# EAGLE design AT24-Timer-NEW (EAGLE 9.6.2)
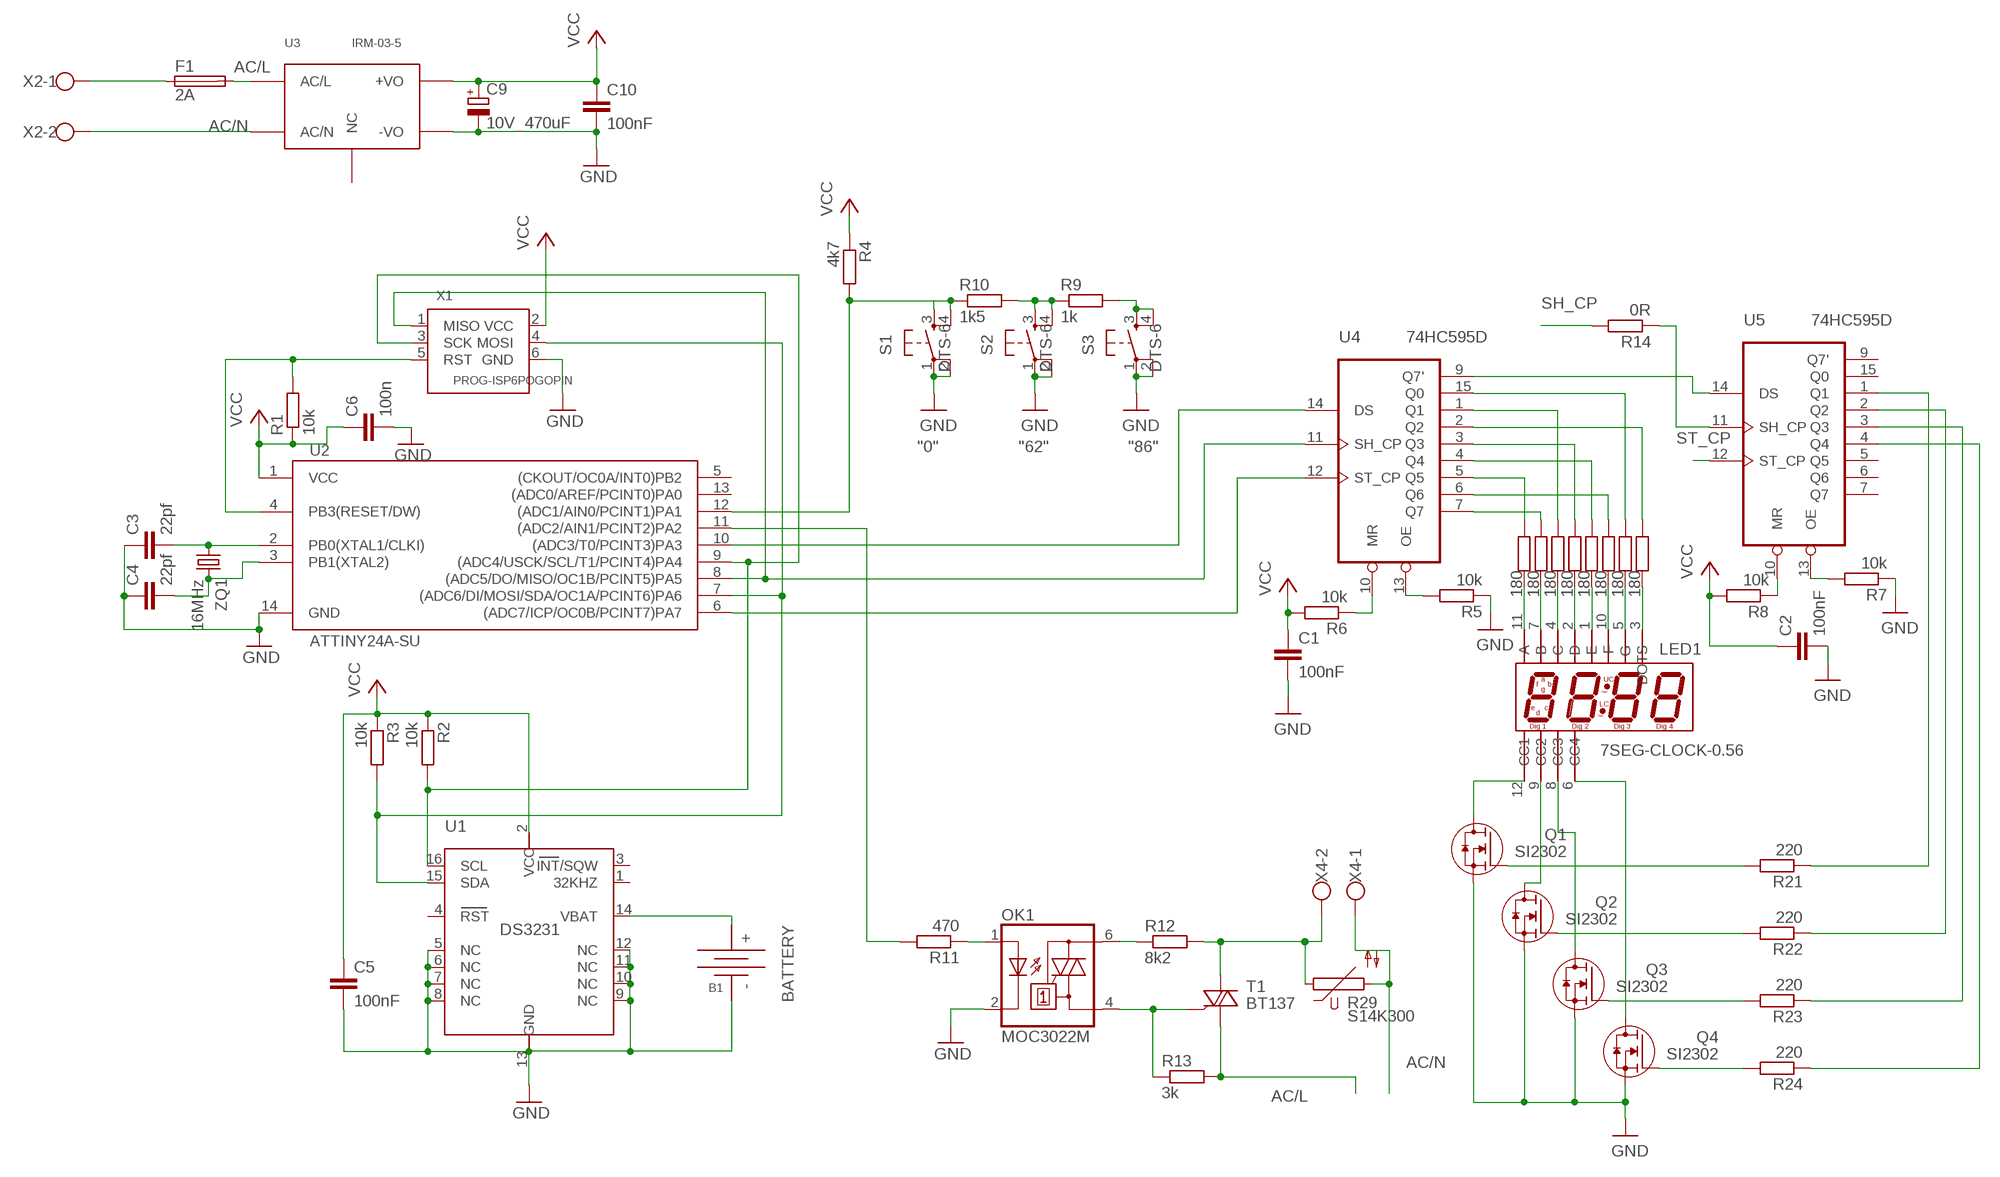
[diagram p0: schematic, sheet 1]

## Parts
B1  BATTERY  [BTH2032-3]
C1  100nF  C-EUC0603  [C0603]
C2  100nF  C-EUC0603  [C0603]
C3  22pf  C-EUC0603  [C0603]
C4  22pf  C-EUC0603  [C0603]
C5  100nF  C-EUC0603  [C0603]
C6  100n  C-EUC0603  [C0603]
C9  10V_470uF  CPOL-EUD/7343-31W  [D/7343-31W]
C10  100nF  C-EUC0805K  [C0805K]
F1  2A  SH22,5A  [SH22,5A]
LED1  7SEG-CLOCK-0.56  [7SEG_4DIG_0.56]
OK1  MOC3022M  [DIL06]
Q1  SI2302  [SOT-23-GSD]
Q2  SI2302  [SOT-23-GSD]
Q3  SI2302  [SOT-23-GSD]
Q4  SI2302  [SOT-23-GSD]
R1  10k  R-EU_R0805  [R0805]
R2  10k  R-EU_R0805  [R0805]
R3  10k  R-EU_R0805  [R0805]
R4  4k7  R-EU_R0805  [R0805]
R5  10k  R-EU_R0805  [R0805]
R6  10k  R-EU_R0805  [R0805]
R7  10k  R0805  [0805R]
R8  10k  R-EU_R0805  [R0805]
R9  1k  R-EU_R0805  [R0805]
R10  1k5  R-EU_R0805  [R0805]
R11  470  R-EU_R0805  [R0805]
R12  8k2  R-EU_0207/7  [0207/7]
R13  3k  R-EU_0207/7  [0207/7]
R14  0R  R0805  [0805R]
R17  180  R-EU_R0805  [R0805]
R18  180  R-EU_R0805  [R0805]
R19  180  R-EU_R0805  [R0805]
R20  180  R-EU_R0805  [R0805]
R21  220  R-EU_R0805  [R0805]
R22  220  R-EU_R0805  [R0805]
R23  220  R-EU_R0805  [R0805]
R24  220  R-EU_R0805  [R0805]
R25  180  R-EU_R0805  [R0805]
R26  180  R-EU_R0805  [R0805]
R27  180  R-EU_R0805  [R0805]
R28  180  R-EU_R0805  [R0805]
R29  S14K300  [S14K300]
S1  DTS-6  [DTS-6]
S2  DTS-6  [DTS-6]
S3  DTS-6  [DTS-6]
T1  BT137  BT136  [TO220AB]
U1  DS3231  [SO16L]
U2  ATTINY24A-SU  [SO14]
U3  IRM-03-5  [IRM-03-*]
U4  74HC595D  [SO16]
U5  74HC595D  [SO16]
X1  PROG-ISP6POGOPIN  [PROG_POGOPIN]
X2  W237-102  [W237-102]
X4  W237-102  [W237-102]
ZQ1  16MHz  CRYSTALHC49S  [HC49/S]

## Nets
AC/L: F1.2 R13.2 T1.1(A1) U3.P$1(AC/L)
AC/N: R29.2 U3.P$2(AC/N) X2.2 X4.1
GND: B1.- C1.2 C2.2 C3.1 C4.1 C5.2 C6.2 C9.- C10.2 OK1.2(C) Q1.S Q2.S Q3.S Q4.S R5.1 R7.1 S1.1 S1.2 S2.1 S2.2 S3.1 S3.2 U1.5(NC) U1.6(NC) U1.7(NC) U1.8(NC) U1.9(NC) U1.10(NC) U1.11(NC) U1.12(NC) U1.13(GND) U2.14(GND) U3.P$4(-VO) X1.6(GND)
N$1: OK1.6(A2) R12.1
N$2: F1.1 X2.1
N$3: R3.2 U1.15(SDA) U2.7((ADC6/DI/MOSI/SDA/OC1A/PCINT6)PA6) X1.4(MOSI)
N$4: R2.2 U1.16(SCL) U2.9((ADC4/USCK/SCL/T1/PCINT4)PA4) X1.3(SCK)
N$5: R1.2 U2.4(PB3(RESET/DW)) X1.5(RST)
N$6: R4.2 R10.1 S1.3 S1.4 U2.12((ADC1/AIN0/PCINT1)PA1)
N$7: C3.2 U2.2(PB0(XTAL1/CLKI)) ZQ1.1
N$8: C4.2 U2.3(PB1(XTAL2)) ZQ1.2
N$9: R6.1 U4.10(MR)
N$10: R12.2 R29.1 T1.2(A2) X4.2
N$11: U2.10((ADC3/T0/PCINT3)PA3) U4.14(DS)
N$12: R14.1 U5.11(SH_CP)
N$16: R9.1 S3.3 S3.4
N$17: OK1.4(A1) R13.1 T1.3(G)
N$20: R5.2 U4.13(OE)
N$21: OK1.1(A) R11.1
N$22: R8.1 U5.10(MR)
N$25: R7.2 U5.13(OE)
N$28: R17.1 U4.5(Q5)
N$29: R18.1 U4.7(Q7)
N$30: U4.9(Q7') U5.14(DS)
N$31: R19.1 U4.1(Q1)
N$32: R20.1 U4.3(Q3)
N$33: R25.1 U4.4(Q4)
N$34: R26.1 U4.6(Q6)
N$35: R27.1 U4.15(Q0)
N$36: R28.1 U4.2(Q2)
N$37: LED1.12(CC1) Q1.D
N$38: LED1.9(CC2) Q2.D
N$39: LED1.8(CC3) Q3.D
N$40: LED1.6(CC4) Q4.D
N$41: R21.1 U5.1(Q1)
N$42: R22.1 U5.2(Q2)
N$43: R23.1 U5.3(Q3)
N$44: R24.1 U5.4(Q4)
N$51: LED1.11(A) R17.2
N$52: LED1.7(B) R18.2
N$55: LED1.4(C) R19.2
N$56: B1.+ U1.14(VBAT)
N$57: LED1.2(D) R20.2
N$58: LED1.1(E) R25.2
N$59: LED1.10(F) R26.2
N$60: LED1.5(G) R27.2
N$61: LED1.3(DOTS) R28.2
N$65: Q4.G R24.2
N$66: Q3.G R23.2
N$67: Q2.G R22.2
N$68: Q1.G R21.2
N$160: R9.2 R10.2 S2.3 S2.4
OPTOCOUP: R11.2 U2.11((ADC2/AIN1/PCINT2)PA2)
SH_CP: R14.2 U2.8((ADC5/DO/MISO/OC1B/PCINT5)PA5) U4.11(SH_CP) X1.1(MISO)
ST_CP: U2.6((ADC7/ICP/OC0B/PCINT7)PA7) U4.12(ST_CP) U5.12(ST_CP)
VCC: C1.1 C2.1 C5.1 C6.1 C9.+ C10.1 R1.1 R2.1 R3.1 R4.1 R6.2 R8.2 U1.2(VCC) U2.1(VCC) U3.P$5(+VO) X1.2(VCC)
Unconnected: U1.1(32KHZ) U1.3(INT/SQW) U1.4(RST) U2.5((CKOUT/OC0A/INT0)PB2) U2.13((ADC0/AREF/PCINT0)PA0) U5.5(Q5) U5.6(Q6) U5.7(Q7) U5.9(Q7') U5.15(Q0)

## Notes on the sheet
- "0" | "62" | "86"

## Power pins joined to a net without a drawn wire
GND: U4.8(GND) U5.8(GND)
NC: U3.P$3(NC)
VCC: U4.16(VCC) U5.16(VCC)

## Library data of the parts
B1 = usb:BATTERY
C1-C6 C10 = rcl:C-EU: CAPACITOR, European symbol; SPICEPREFIX: C
C9 = rcl:CPOL-EU: POLARIZED CAPACITOR, European symbol; SPICEPREFIX: C
F1 = fuse:SH22,5A: FUSE HOLDER grid 22,5mm, isolated cap OGN0031 8201, Schurter (Buerklin); MPN: 0031.7701.11; OC_FARNELL: unknown; OC_NEWARK: 04F1224
LED1 = usb:7SEG-CLOCK-0.56
OK1 = optocoupler:MOC30*M: RANDOM-PHASE OPTOISOLATORS TRIAC DRIVER OUTPUT Source: http://www.fairchildsemi.com MOC3020-M.pdf; MF: FAIRCHILD SEMICONDUCTOR; MPN: MOC3022-M; OC_FARNELL: 1021086; OC_NEWARK: 58K1956
Q1-Q4 = usb:SI2302: N-канальный полевик
R1-R6 R8-R13 R17-R28 = rcl:R-EU_: RESISTOR, European symbol; SPICEPREFIX: R
R7 R14 = usb:R0805
R29 = varistor:S14K300: VARISTOR
S1-S3 = usb:DTS-6
T1 = triac:BT136: Triac BT136 series E sensitive gate Source: http://www.nxp.com/acrobat_download/datasheets/BT136_SERIES_E_2.pdf
U1 = usb:DS3231: Real-Time Clock DS3231
U2 = usb:ATTINY24A: ATTiny24A ATTiny44A ATTiny84A
U3 = usb:IRM-03-*: IRM-03-*
U4 U5 = 74xx-eu:74*595: 8-bit SHIFT REGISTER, output latch
X1 = usb:PROG-ISP
X2 X4 = con-wago-500:W237-102: WAGO SCREW CLAMP; MPN: 237-102; OC_FARNELL: unknown; OC_NEWARK: 70K9898
ZQ1 = crystal:CRYSTAL: CRYSTAL; OC_FARNELL: 1667008; OC_NEWARK: unknown

## Board
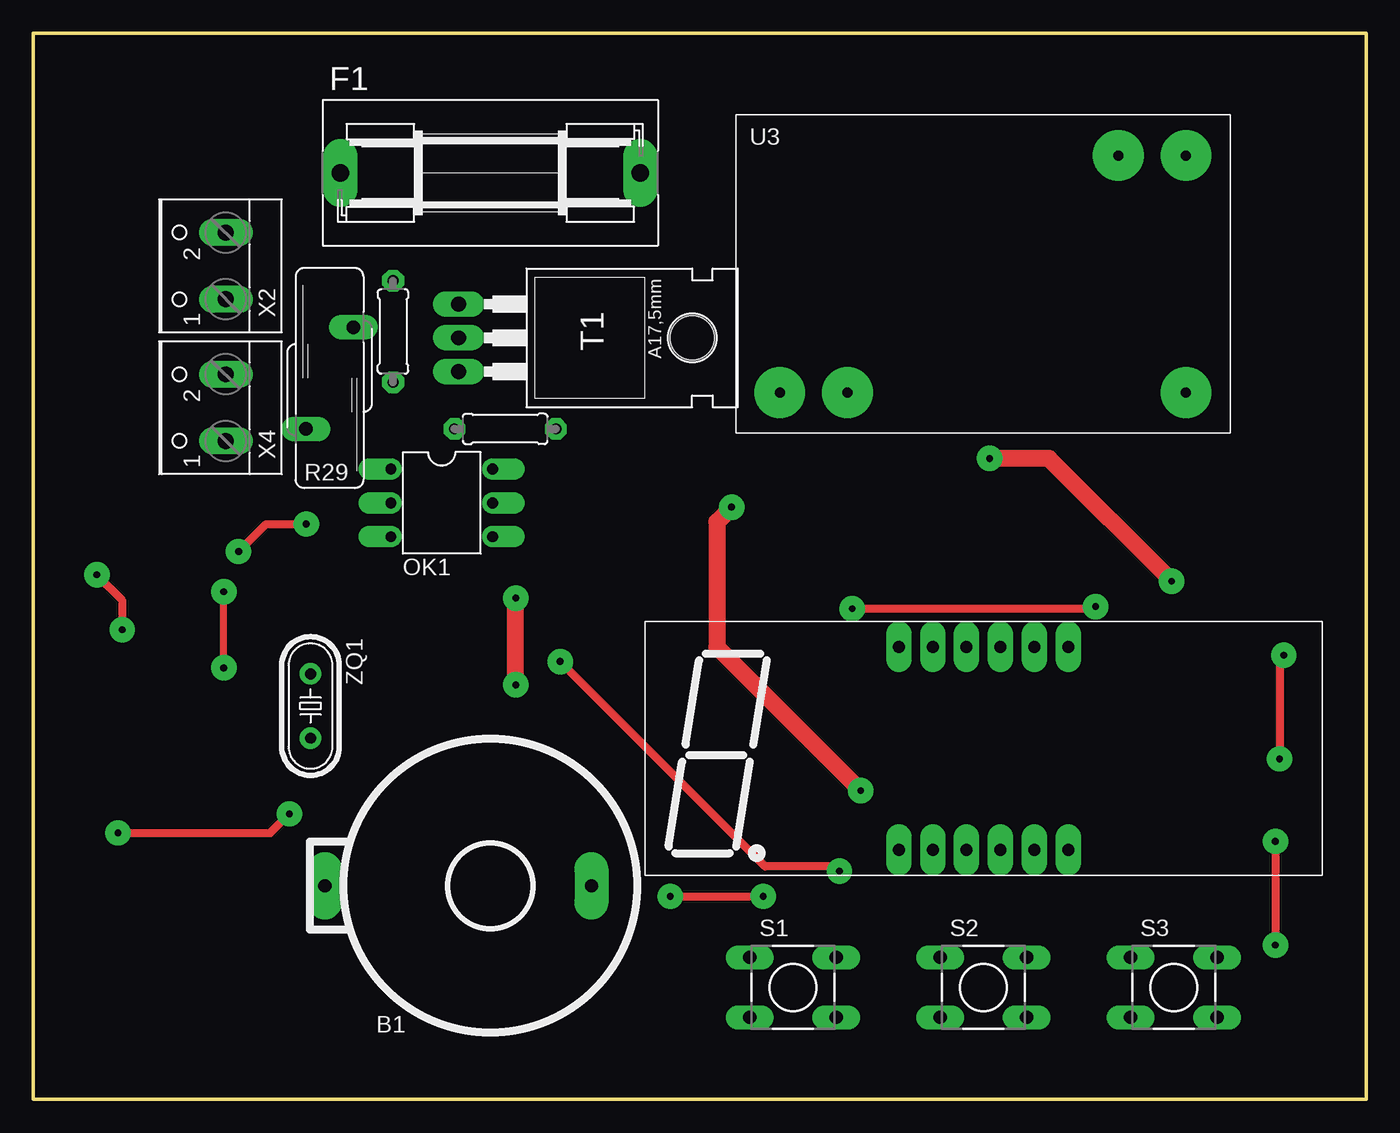
[diagram p1: board, top side]
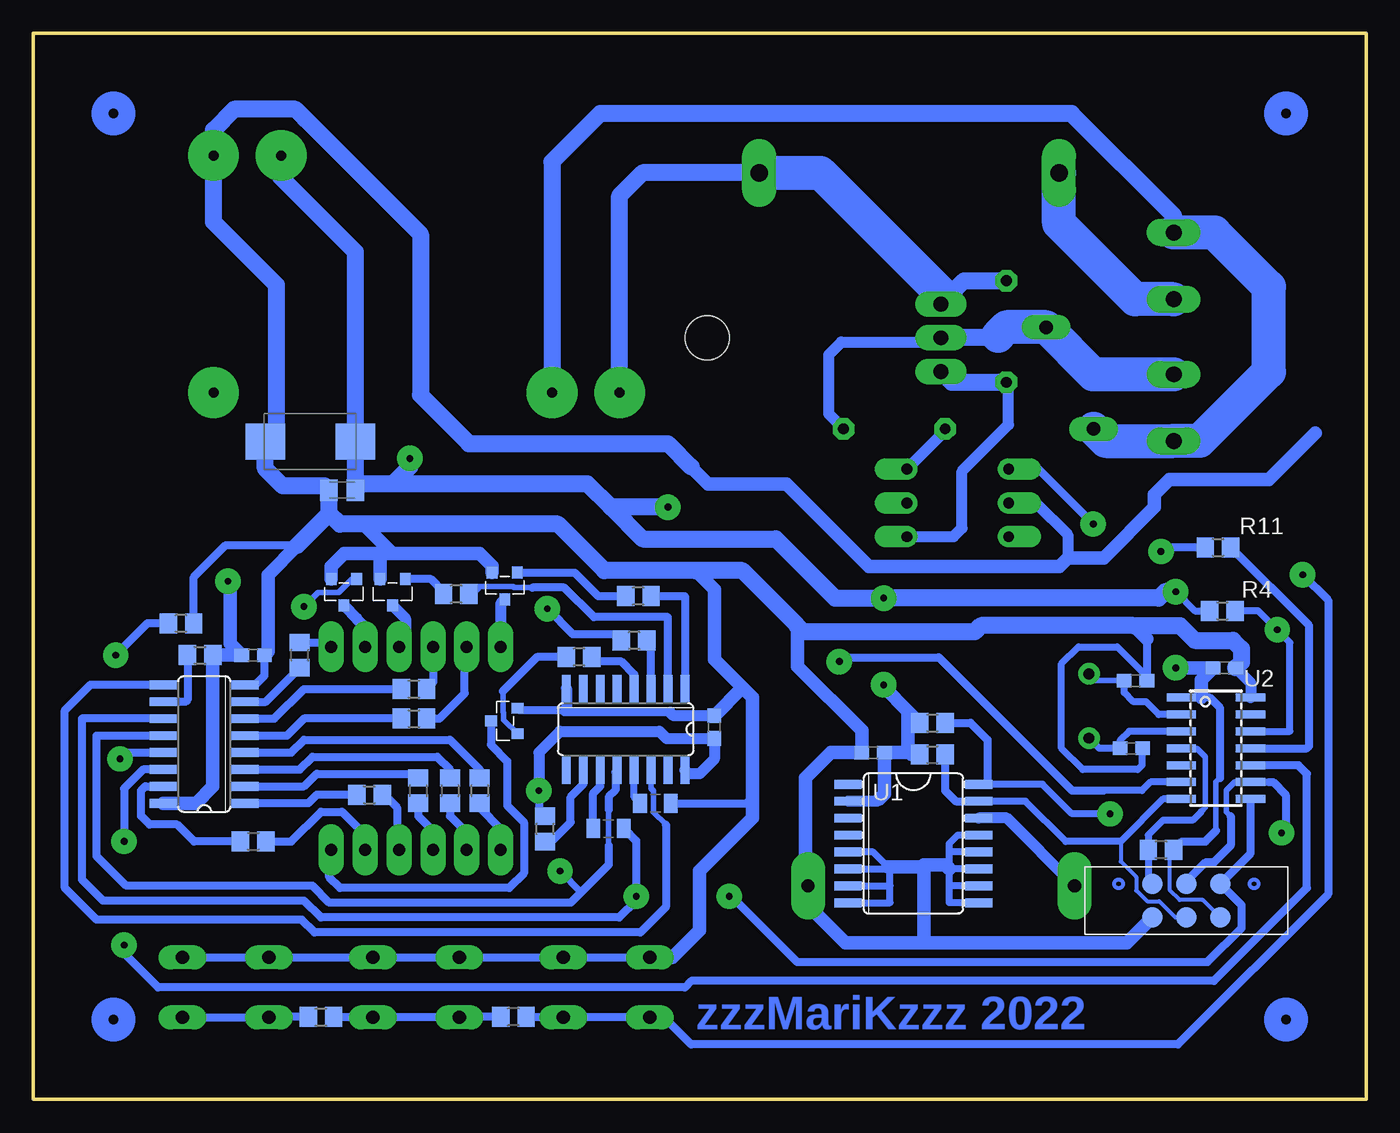
[diagram p2: board, bottom side, seen from below]

Size 100 x 80 mm. Coordinates in mm from the lower left corner, seen from the top.
Outline: 0,0 100,0 100,80 0,80 0,0
Copper layers (1*16): Top 0.035mm / dielectric 1.5mm / Bottom 0.035mm
Design rules "default *": minimum track width 12mil, minimum drill 20mil, track to track 12mil, track to pad 12mil, pad to pad 12mil, via to via 12mil, smd to smd 8mil, copper to edge 20mil, drill to drill 8mil, minimum pad ring 16mil, minimum via ring 12mil, stop-mask expansion 4mil, vias tented up to drill 0mil, thermal gap 20mil

### Footprints (pad centres in the part's own frame; a part is rotated, then mirrored left to right if it is on the bottom)
BTH2032-3 = drill 1 pad 2.54 long: + 0,-20.032; - 0,-0.033
C0603 = smd 1.1 x 1: 1 -0.85,0; 2 0.85,0
D/7343-31W = smd 2.95 x 2.7: + 3.375,0; - -3.375,0
C0805K = smd 1.3 x 1.6: 1 -1,0; 2 1,0
SH22,5A = drill 1.321 pad 2.54 long: 1 -11.252,0; 2 11.252,0
7SEG_4DIG_0.56 = drill 0.9 pad 1.93 long: 1 -5.08,-2.54; 2 -2.54,-2.54; 3 0,-2.54; 4 2.54,-2.54; 5 5.08,-2.54; 6 7.62,-2.54; 7 7.62,12.7; 8 5.08,12.7; 9 2.54,12.7; 10 0,12.7; 11 -2.54,12.7; 12 -5.08,12.7
DIL06 = drill 0.813 offset: 1 -2.54,-3.81; 2 0,-3.81; 3 2.54,-3.81; 4 2.54,3.81; 5 0,3.81; 6 -2.54,3.81
SOT-23-GSD = smd 0.8 x 0.9: D 0,2; G -0.95,0; S 0.95,0
R0805 = smd 1.3 x 1.5: 1 -0.95,0; 2 0.95,0
0805R = smd 1.016 x 1.422: 1 -1.16,0.01; 2 1.14,0.01
0207/7 = drill 0.813 octagon: 1 -3.81,0; 2 3.81,0
S14K300 = drill 1.016 long: 1 -1.778,-3.81; 2 1.778,3.81
DTS-6 = drill 1 long: 1 -3.25,2.25; 2 3.25,2.25; 3 -3.25,-2.25; 4 3.25,-2.25
TO220AB = drill 1.118 long: 1 -2.54,-6.35; 2 0,-6.35; 3 2.54,-6.35 | hole 3.302: 0,11.176
SO16L = smd 0.66 x 2.032: 1 -4.445,-4.902; 2 -3.175,-4.902; 3 -1.905,-4.902; 4 -0.635,-4.902; 5 0.635,-4.902; 6 1.905,-4.902; 7 3.175,-4.902; 8 4.445,-4.902; 9 4.445,4.902; 10 3.175,4.902; 11 1.905,4.902; 12 0.635,4.902; 13 -0.635,4.902; 14 -1.905,4.902; 15 -3.175,4.902; 16 -4.445,4.902
SO14 = smd 0.6 x 2.2: 1 -3.81,-2.6; 2 -2.54,-2.6; 3 -1.27,-2.6; 4 0,-2.6; 5 1.27,-2.6; 6 2.54,-2.6; 7 3.81,-2.6; 8 3.81,2.6; 9 2.54,2.6; 10 1.27,2.6; 11 0,2.6; 12 -1.27,2.6; 13 -2.54,2.6; 14 -3.81,2.6
IRM-03-* = drill 0.75 pad 3.81: P$1 3.302,3.048; P$2 8.382,3.048; P$3 33.782,3.048; P$4 33.782,20.828; P$5 28.702,20.828
SO16 = smd 0.66 x 2.032: 1 -4.445,-3.073; 2 -3.175,-3.073; 3 -1.905,-3.073; 4 -0.635,-3.073; 5 0.635,-3.073; 6 1.905,-3.073; 7 3.175,-3.073; 8 4.445,-3.073; 9 4.445,3.073; 10 3.175,3.073; 11 1.905,3.073; 12 0.635,3.073; 13 -0.635,3.073; 14 -1.905,3.073; 15 -3.175,3.073; 16 -4.445,3.073
PROG_POGOPIN = smd 1.524 x 1.524: 1 0,7.62; 2 2.54,7.62; 3 0,5.08; 4 2.54,5.08; 5 0,2.54; 6 2.54,2.54
W237-102 = drill 1.194 long: 1 -2.5,-1.27; 2 2.5,-1.27
HC49/S = drill 0.813: 1 -2.413,0; 2 2.413,0

### Placement (x,y rotation side)
B1  41.91,16.03 270 top
C1  48.91,27.94 90 bottom
C2  83.52,33.34 0 bottom
C3  17.3,31.43 180 bottom
C4  17.62,26.35 180 bottom
C5  36.99,26.04 180 bottom
C6  10.64,32.38 0 bottom
C9  79.22,49.37 0 bottom
C10  76.83,45.72 180 bottom
F1  34.29,69.53 0 top
LED1  70.02,21.27 0 top
OK1  30.64,44.77 270 top
Q1  64.62,39.53 180 bottom
Q2  73.04,39.05 180 bottom
Q3  76.69,39.05 180 bottom
Q4  63.66,28.4 90 bottom
R1  15.4,18.73 180 bottom
R2  32.54,28.26 0 bottom
R3  32.54,25.88 0 bottom
R4  10.79,36.67 0 bottom
R5  88.91,35.72 180 bottom
R6  87.48,33.34 0 bottom
R7  53.34,22.24 180 bottom
R8  61.59,20.31 90 bottom
R9  78.42,6.19 0 bottom
R10  63.98,6.19 180 bottom
R11  11.11,41.43 0 bottom
R12  35.4,50.32 0 top
R13  26.99,57.63 90 top
R14  56.83,20.32 0 bottom
R17  71.44,28.57 0 bottom
R18  80.01,33.34 90 bottom
R19  74.77,22.86 0 bottom
R20  68.74,23.18 270 bottom
R21  54.61,37.77 180 bottom
R22  68.26,37.93 180 bottom
R23  54.93,34.44 180 bottom
R24  59.05,33.19 180 bottom
R25  66.52,23.18 270 bottom
R26  71.44,30.8 0 bottom
R27  83.5,19.37 0 bottom
R28  71.12,23.18 270 bottom
R29  22.23,54.13 180 top
S1  56.99,8.41 0 top
S2  71.28,8.41 0 top
S3  85.57,8.41 0 top
T1  38.26,57.15 270 top
U1  33.97,19.21 270 bottom
U2  11.27,26.35 270 bottom
U3  52.7,50.01 0 top
U4  87.17,26.67 90 bottom
U5  55.56,27.78 180 bottom
X1  18.57,16.19 270 bottom
X2  13.18,62.55 90 top
X4  13.18,51.91 90 top
ZQ1  20.8,29.53 270 top

### Tracks (layer width: path | path; a pad name or v marks a point on that pad's centre or on a via)
AC/L
  Bottom 1.27: U3.P$1 56.01,67.82 54.29,69.53 F1.2 | T1.1 31.51,60.09 30.16,61.44 R13.2
  Bottom 2.54: F1.2 40.96,69.53 31.51,60.09
AC/N
  Bottom 1.27: X2.2 14.45,66.32 22.11,73.98 57.47,73.98 61.09,70.36 U3.P$2
  Bottom 2.54: R29.2 19.54,49.41 X4.1 12.5,49.41 7.3,54.61 7.3,60.96 11.39,65.05 X2.2
GND
  Bottom 0.406: C4.1 17.14,26.35 | 16.45,32.01 16.45,31.75
  Bottom 0.508: 35.72,16.03 35.72,14.76 U1.8 | 35.72,16.03 35.72,17.3 35.88,17.46 | 35.88,17.46 36.99,18.57 U1.5 | U1.6 36.04,17.3 35.88,17.46 | U1.7 35.72,16.03 | 31.27,16.03 31.27,14.76 U1.9 | 31.27,16.03 31.27,17.3 | 31.27,17.3 31.27,18.57 | 31.27,18.57 31.27,19.21 30.64,19.84 U1.13 | U1.12 31.27,18.57 | U1.11 31.27,17.3 | U1.10 31.27,16.03 | C4.1 16.83,26.3 16.83,25.08 17.14,24.77 21.27,24.77 22.86,26.35 22.86,32.7 21.59,33.97 18.68,33.97 16.45,31.75
  Bottom 0.61: 52.23,29.05 60.17,29.05 60.01,29.21 63.52,29.21 Q4.S | C2.2 82.67,31.79 83.34,31.11 U4.8 | C6.2 9.84,32.44 | 16.45,34.55 16.45,31.75 C3.1 | R5.1 87.96,39.2 85.57,41.59 80.17,41.59 | R7.1 46.51,22.23 46.04,22.7 | S3.2 S3.1 S2.2 S2.1 S1.2 S1.1 52.04,10.66
  Bottom 0.813: C6.2 8.67,31.27 U2.14 | U5.8 60.01,29.21 | 79.53,73.66 79.61,73.58 | OK1.2 24.77,44.77 22.38,42.39 22.38,40.64 | C1.2 51.97,28.79 52.23,29.05
  Bottom 1.016: 16.45,34.55 17.46,35.56 | 52.04,10.66 50.01,12.7 50.01,17.14 46.04,21.11 46.04,22.7 46.04,30.16 46.75,30.88 | X1.6 17.94,11.75 33.18,11.75 | C2.2 82.39,33.61 82.39,39.37 80.17,41.59 | 3.81,50.01 7.3,46.51 14.76,46.51 15.88,45.4 15.88,44.45 19.68,40.64 22.38,40.64 23.02,40.01 37.31,40.01 43.5,46.2 49.37,46.2 50.64,47.47 | C5.2 37.94,26.04 | 33.18,11.75 39.05,11.75 41.88,14.57 B1.- 42.07,16.23 42.07,24.13 40.16,26.04 C5.2 | 33.18,17.62 33.18,11.75 | 31.27,17.3 31.59,17.62 33.18,17.62 | 35.88,17.46 33.34,17.46 33.18,17.62 | C5.2 37.84,27.68 42.67,32.51 42.67,35.53 | 46.75,30.88 48.91,33.03 48.91,38.27 50.32,39.69 | 46.75,30.88 46.82,30.88 C1.2 | 75.09,43.18 75.09,43.02 73.03,40.96 | 73.03,40.96 66.52,40.96 65.58,40.02 Q1.S | 73.03,40.96 73.82,40.96 | 73.82,40.96 76.68,40.96 77.64,39.99 Q3.S | Q2.S 73.99,40.79 73.82,40.96
  Bottom 1.27: 87.31,70.01 U3.P$4 | C6.2 9.37,32.8 9.37,33.81 10,34.45 12.86,34.45 13.97,35.56 17.46,35.56 28.89,35.56 29.37,35.08 42.23,35.08 42.67,35.53 42.67,35.56 46.8,39.69 50.32,39.69 57.15,39.69 60.64,43.18 75.09,43.18 76.99,43.18 77.83,44.02 | 50.64,47.47 52.39,49.21 67.31,49.21 70.96,52.86 70.96,64.93 79.61,73.58 80.33,74.3 84.93,74.3 86.49,72.74 U3.P$4 | 77.83,44.02 C10.2 78.15,46.04 81.28,46.04 82.59,47.35 C9.- 81.76,50.21 81.76,61.12 86.49,65.85 U3.P$4 | 77.83,44.02 77.83,43.93 80.17,41.59
N$1
  Bottom 0.813: OK1.6 31.59,50.16 R12.1
N$2
  Bottom 2.54: X2.1 17.34,60.05 23.04,65.74 F1.1
N$3
  Bottom 0.305: 18.41,19.37 18.41,17.86 17.25,16.7 17.25,15.69 16.44,14.87 15.53,14.87 14.31,13.65 X1.4
  Bottom 0.508: U2.7 15.24,22.54 18.41,19.37 22.54,19.37 25.56,22.38 U1.15
  Bottom 0.61: R3.2 31.59,23.18 30.8,22.38 U1.15
N$4  (via drill 0.51 pad 1.91)
  Top 0.61: v6.35,20 17.78,20 v19.21,21.43
  Bottom 0.406: U2.9 9.84,23.81 10.48,23.18 10.48,21.59 10.16,21.27
  Bottom 0.508: U2.9 7.3,23.81 | v19.21,21.43 22.07,21.43 24.29,23.65 28.42,23.65 U1.16
  Bottom 0.61: 7.3,23.81 6.99,23.81 6.03,22.86 6.03,20.32 v6.35,20 | 10.16,21.27 10.16,19.05 11.43,17.78 12.06,17.78 13.49,16.35 X1.3 | R2.2 29.69,28.26 28.42,26.99 28.42,23.65
N$5
  Bottom 0.406: U2.4 12.7,26.35 12.06,25.72 12.06,21.91 12.38,21.59
  Bottom 0.508: X1.5 16.35,16.51 R1.2 16.35,19.85 15.24,20.95 13.02,20.95 12.38,21.59
N$6  (via drill 0.51 pad 1.91)
  Top 0.61: v4.76,39.37 6.67,37.47 v6.67,35.24
  Bottom 0.508: U2.12 5.71,27.62 5.71,34.29 v6.67,35.24 8.1,36.67 R4.2
  Bottom 0.61: 63.03,6.16 R10.1 63,6.16 S1.4 S1.3 52.73,6.16 52.7,6.19 50.64,4.13 14.13,4.13 2.86,15.4 2.86,37.47 v4.76,39.37
N$7
  Bottom 0.406: C3.2 20.29,31.43 ZQ1.1
  Bottom 0.508: U2.2 15.56,28.89 16.51,29.84 17.46,29.84 18.15,30.54 C3.2
N$8
  Bottom 0.508: U2.3 17.78,27.62 18.47,26.93 C4.2 20.03,26.35 ZQ1.2
N$9
  Bottom 0.61: R6.1 88.44,29.99 88.58,29.84 U4.10
N$10
  Bottom 0.813: R12.2 40.32,51.44 40.32,55.88 39.37,56.83 31.59,56.83
  Bottom 1.27: 31.59,56.83 T1.2 27.78,57.15 27.62,57.31
  Bottom 2.54: 27.62,57.31 26.99,57.94 R29.1 20.47,54.41 X4.2
N$11  (via drill 0.51 pad 1.91)
  Top 0.61: v93.19,19.37 v93.19,11.59
  Bottom 0.61: U4.14 91.76,24.77 93.19,23.34 v93.19,19.37 | U2.10 5.08,25.08 4.45,24.45 4.45,15.88 11.43,8.89 50.64,8.89 51.12,8.41 90.65,8.41 93.19,10.95 v93.19,11.59
N$12
  Bottom 0.61: R14.1 57.99,22.97 57.47,23.5 U5.11
N$16
  Bottom 0.61: 79.37,6.16 R9.1 82.29,6.19 S3.3 S3.4
N$17
  Bottom 0.813: OK1.4 30.96,42.23 30.32,42.86 30.32,47.15 26.83,50.64 26.83,53.66 R13.1
  Bottom 1.27: T1.3 31.11,53.82 R13.1
N$20  (via drill 0.51 pad 1.91)
  Top 0.61: v93.82,33.34 93.5,33.02 v93.5,25.56
  Bottom 0.61: R5.2 91.44,35.72 v93.82,33.34 | v93.5,25.56 93.5,25.88 93.34,26.04 U4.13
N$21  (via drill 0.51 pad 1.91)
  Top 0.61: v15.4,41.12 17.46,43.18 v20.48,43.18
  Bottom 0.61: v20.48,43.18 24.61,47.31 OK1.1 | R11.1 15.08,41.43 v15.4,41.12
N$22
  Bottom 0.61: R8.1 61.13,19.36 59.69,20.8 59.69,22.7 58.74,23.65 U5.10
N$25
  Bottom 0.508: R7.2 54.93,22.68 U5.13
N$28
  Bottom 0.61: U4.5 80.96,27.3 79.69,28.57 R17.1
N$29
  Bottom 0.61: U4.7 82.55,29.84 R18.1
N$30
  Bottom 0.406: U5.14 53.66,23.34 53.46,23.15 53.46,21.55 52.55,20.64
  Bottom 0.61: U4.9 95.73,31.11 97.63,29.21 97.63,15.88 95.25,13.49 79.85,13.49 78.9,12.54 54.45,12.54 52.55,14.45 52.55,20.64
N$31
  Bottom 0.61: R19.1 78.74,22.86 79.38,22.23 U4.1
N$32
  Bottom 0.61: U4.3 80.01,24.77 79.06,25.72 69.69,25.72 68.74,24.77 R20.1
N$33
  Bottom 0.61: U4.4 80.64,26.04 79.69,26.99 68.74,26.99 66.52,24.77 R25.1
N$34
  Bottom 0.61: U4.6 81.92,28.57 79.69,30.8 R26.1
N$35
  Bottom 0.61: R27.1 87.95,19.37 89.22,20.64 91.28,20.64 91.92,21.27 91.92,23.18 91.6,23.5 U4.15
N$36
  Bottom 0.61: U4.2 79.69,23.5 78.74,24.45 71.44,24.45 R28.1
N$37
  Bottom 0.813: Q1.D 64.94,37.21 LED1.12
N$38
  Bottom 0.813: Q2.D 72.09,36.1 72.09,34.45 LED1.9
N$39
  Bottom 0.813: Q3.D 75.74,36.1 75.74,36.05 75.25,35.56 75.25,34.12 LED1.8
N$40
  Bottom 0.61: LED1.6 77.79,18.59 77.79,16.67 76.99,15.88 64.29,15.88 63.18,16.99 63.18,20.8 64.44,22.05 64.44,25.39 65.66,26.61 Q4.D
N$41
  Bottom 0.61: R21.1 51.12,37.77 U5.1
N$42
  Bottom 0.406: 62.55,38.42 63.95,38.42 64.02,38.49 66.61,38.49 66.67,38.42
  Bottom 0.61: R22.1 67.17,37.93 66.67,38.42 | U5.2 52.39,36.2 57.94,36.2 60.17,38.42 62.55,38.42
N$43
  Bottom 0.61: U5.3 53.66,34.12 R23.1
N$44
  Bottom 0.61: U5.4 54.93,31.91 55.88,32.86 57.77,32.86 R24.1
N$51
  Bottom 0.61: R17.2 69.53,28.57 67.63,30.48 67.63,33.83 LED1.11
N$52
  Bottom 0.61: R18.2 77.96,34.29 LED1.7
N$55
  Bottom 0.61: R19.2 73.66,22.86 72.71,21.91 72.71,18.88 LED1.4
N$56
  Bottom 0.813: B1.+ 26.96,21.11 U1.14
N$57
  Bottom 0.61: R20.2 68.74,21.27 67.47,20 67.47,18.75 LED1.2
N$58
  Bottom 0.61: R25.2 66.52,21.91 64.93,20.32 64.93,18.75 LED1.1
N$59
  Bottom 0.61: LED1.10 70.02,31.26 R26.2
N$60
  Bottom 0.61: R27.2 80.64,19.37 78.42,21.59 76.83,21.59 74.93,19.68 74.93,18.91 LED1.5
N$61
  Bottom 0.61: R28.2 71.12,21.27 70.01,20.16 70.01,18.75 LED1.3
N$65
  Bottom 0.406: 64.77,30.64 64.77,29.08 64.7,29.01 64.7,28.49 Q4.G
  Bottom 0.61: 60.18,33.02 R24.2 62.22,33.19 64.77,30.64
N$66  (via drill 0.51 pad 1.91)
  Top 0.61: v61.44,36.83 79.53,36.83 v79.69,36.99
  Bottom 0.406: v79.69,36.99 78.64,38.04 77.09,38.04 76.07,39.05 Q3.G
  Bottom 0.61: v61.44,36.83 59.53,34.92 56.37,34.92 R23.2
N$67
  Bottom 0.61: R22.2 69.21,38.1 70.17,39.05 Q2.G
N$68
  Bottom 0.61: Q1.G 59.38,39.53 57.62,37.77 R21.2
N$160
  Bottom 0.61: 68.03,6.19 S2.3 S2.4 77.47,6.16 R9.2 | R10.2 68.03,6.19 | 68.03,6.19 68.06,6.16
OPTOCOUP
  Bottom 0.61: U2.11 4.45,26.35 4.29,26.51 4.29,35.56 R11.2
SH_CP  (via drill 0.51 pad 1.91)
  Top 0.61: v47.78,15.24 v54.77,15.24
  Bottom 0.61: U4.11 96.36,28.57 96.36,16.51 94.77,14.92 79.69,14.92 78.42,13.65 56.04,13.65 54.77,14.92 v54.77,15.24 54.77,19.41 R14.2 | v47.78,15.24 47.62,15.24 42.7,10.32 11.91,10.32 9.37,12.86 9.37,14.61 X1.1 8.67,18.48 U2.8
ST_CP  (via drill 0.51 pad 1.91)
  Top 0.61: v60.48,17.14 60.14,17.48 54.91,17.48 v39.53,32.86
  Bottom 0.406: 56.83,21.75 56.83,19.05
  Bottom 0.508: U2.6 16.19,23.81 16.83,23.18 19.68,23.18 20,23.18 | v60.48,17.14 58.9,15.56
  Bottom 0.61: U4.12 95.25,27.3 95.25,18.26 93.03,16.03 79.06,16.03 77.79,14.76 59.69,14.76 58.9,15.56 56.83,17.62 56.83,19.05 | v39.53,32.86 39.21,33.18 32.07,33.18 22.07,23.18 19.68,23.18 | 56.83,21.75 56.83,22.7 56.33,23.21 56.33,24.58 U5.12
VCC  (via drill 0.51 pad 1.91)
  Top 0.508: v14.29,32.38 v14.29,38.1
  Top 1.27: v62.07,23.18 51.28,33.97 51.28,43.34 v52.39,44.45 | v36.2,31.11 v36.2,37.62 | v85.41,38.89 76.2,48.1 v71.75,48.1
  Bottom 0.305: R1.1 14.71,18.47 14.71,15.69 14,14.97 12.28,14.97 X1.2
  Bottom 0.406: 13.71,30.16 U2.1 | 10.95,24.13 11.27,23.81 11.27,20.16 | 10.95,14.13 X1.2
  Bottom 0.508: v14.29,38.1 12.86,36.67 R4.1
  Bottom 0.61: R1.1 13.81,19.37 12.06,19.37 11.27,20.16 | 10.95,24.13 10.95,29.37 11.75,30.16 12.38,30.16 13.71,30.16 | 62.05,23.18 v62.07,23.18 62.07,21.73 R8.2
  Bottom 0.813: v62.07,23.18 62.07,26.04 60.48,27.62 53.02,27.62 52.49,27.09 C1.1 48.91,25.55 50.01,24.45 50.86,24.45 U5.16 | 36.51,22.54 36.67,22.38 U1.2
  Bottom 1.016: v14.29,32.38 C6.1 12.38,31.49 12.38,30.16 | v36.2,31.11 36.2,30.96 34.37,29.13 | 34.37,29.13 R2.1 | 34.37,29.13 34.37,26.11 | 34.37,26.11 34.13,25.88 R3.1 | U4.16 87.79,22.23 86.53,23.48 R6.2 C2.1 85.25,34.22 85.25,38.73 v85.41,38.89 | 34.37,26.11 34.45,26.04 C5.1 36.14,22.92 36.51,22.54
  Bottom 1.27: 56.67,44.45 58.42,46.2 73.03,46.2 | 56.67,44.45 54.29,42.07 44.29,42.07 39.85,37.62 v36.2,37.62 15.56,37.62 15.08,38.1 v14.29,38.1 | v52.39,44.45 56.67,44.45 | 73.03,46.2 75.36,46.2 C10.1 C9.+ 75.84,63.62 81.41,69.18 U3.P$5 | v71.75,48.1 71.75,47.47 73.03,46.2
(copper drawn outside any net)
  shapes: Bottom circle x4

### Text on the board
Bottom: zzzMariKzzz 2022